# EAGLE schematic 20140816_PIC16F1827_BASE (EAGLE 7.1.0)
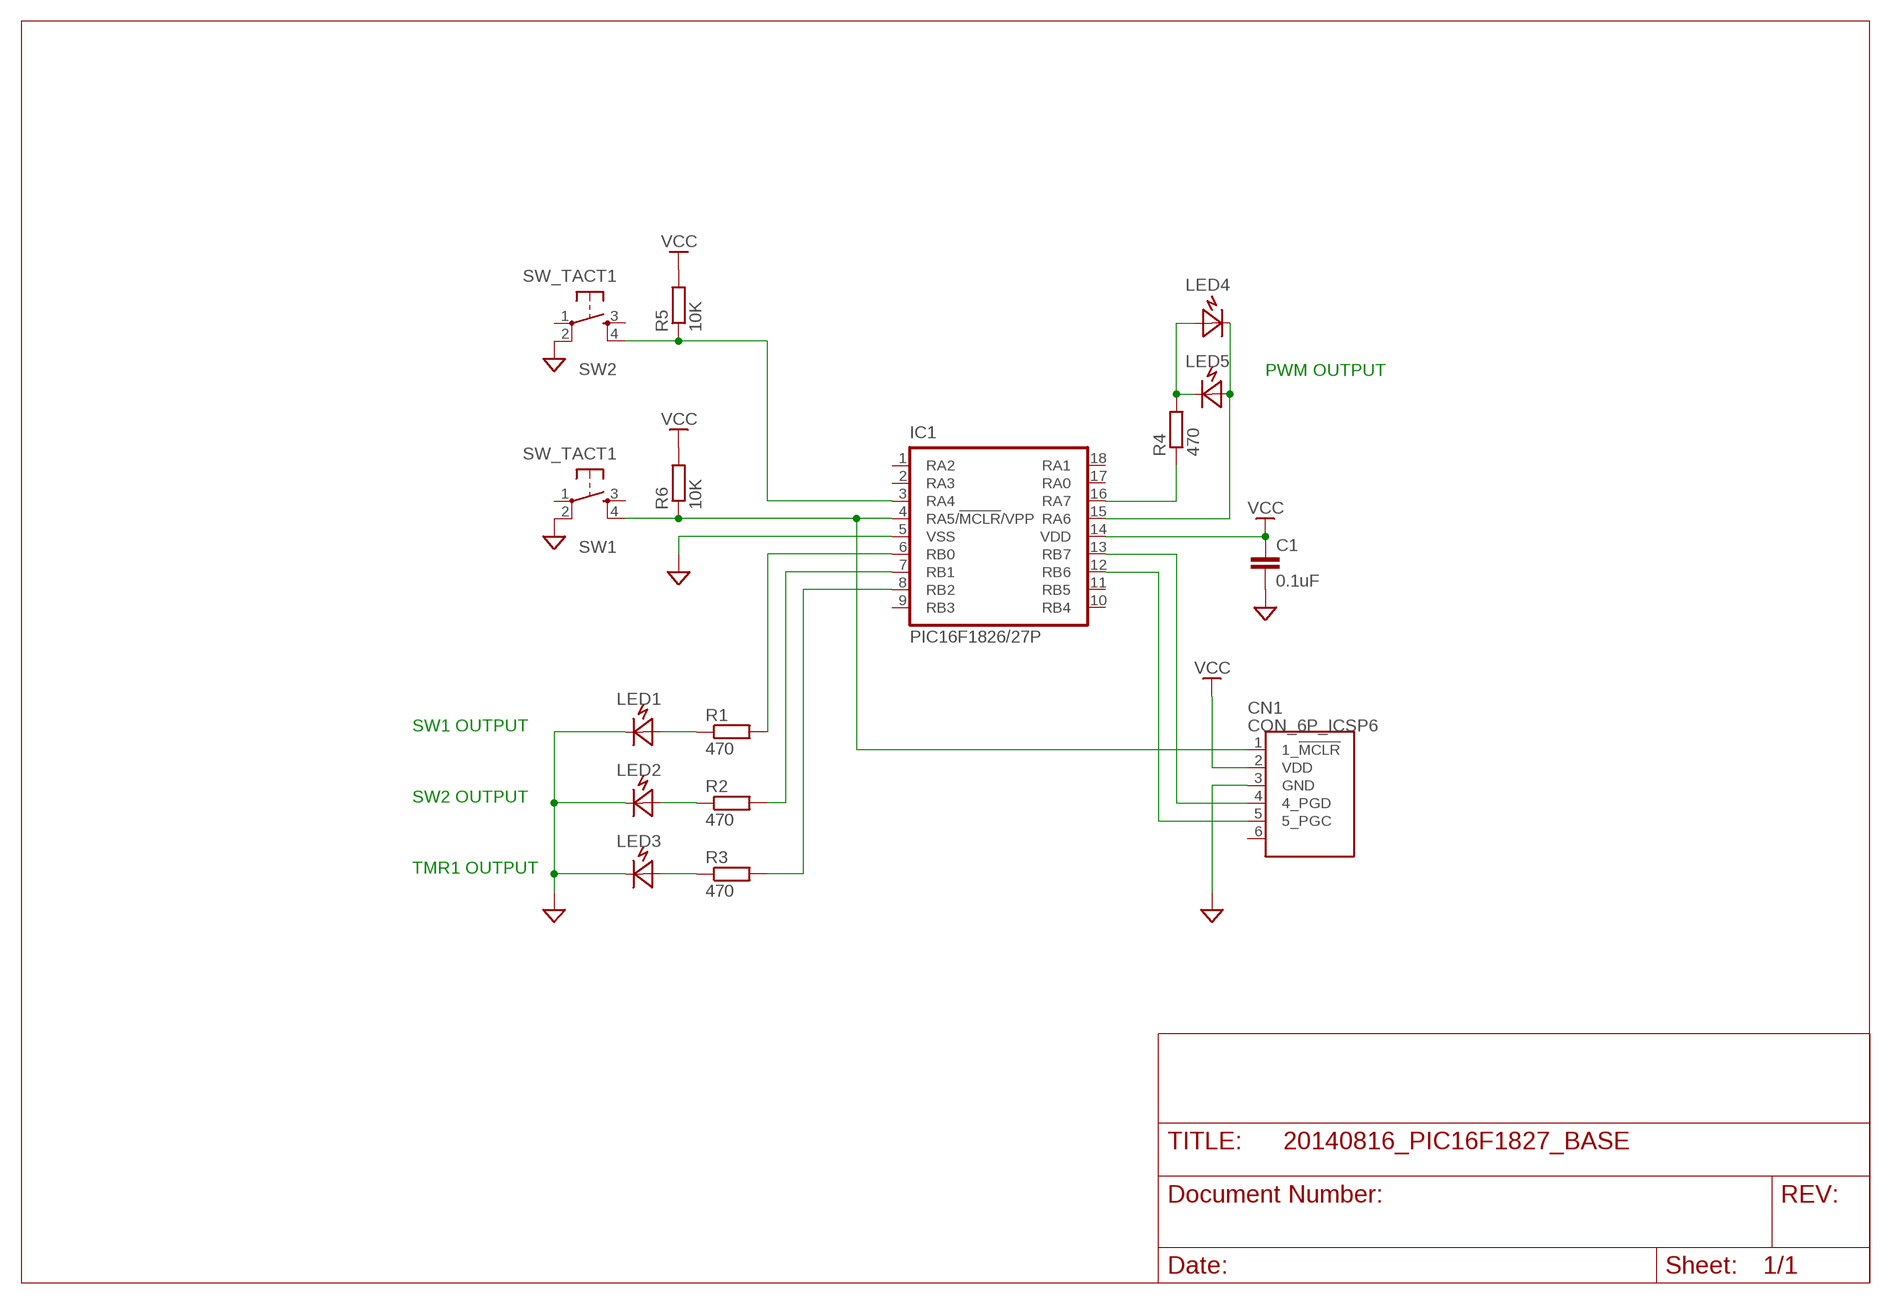
[diagram p0: schematic, sheet 1]

## Parts
C1  0.1uF  C-EU2025-025X050A  [C025-025X050-A]
CN1  CON_6P_ICSP6  [CON_HRS_DIP_6]
IC1  PIC16F1826/27P  [DIL18]
LED1  LED""  [LED_3MM_VIRT_2]
LED2  LED""  [LED_3MM_VIRT_2]
LED3  LED""  [LED_3MM_VIRT_2]
LED4  LED""  [LED_3MM_VIRT_2]
LED5  LED""  [LED_3MM_VIRT_2]
R1  470  R-EU20204/5A  [0204/5-A]
R2  470  R-EU20204/5A  [0204/5-A]
R3  470  R-EU20204/5A  [0204/5-A]
R4  470  R-EU20204/5A  [0204/5-A]
R5  10K  R-EU20204/5A  [0204/5-A]
R6  10K  R-EU20204/5A  [0204/5-A]
SW1  SW_TACT1  [SW_TACT]
SW2  SW_TACT1  [SW_TACT]

## Nets
GND: C1.2 CN1.3(GND) IC1.5(VSS) LED1.K LED2.K LED3.K SW1.2(P1) SW2.2(P1)
N$1: IC1.6(RB0) R1.2
N$2: IC1.7(RB1) R2.2
N$3: IC1.8(RB2) R3.2
N$4: LED1.A R1.1
N$5: LED2.A R2.1
N$6: LED3.A R3.1
N$7: CN1.1(1_!MCLR) IC1.4(RA5/!MCLR!/VPP) R6.1 SW1.4(S1)
N$8: IC1.3(RA4) R5.1 SW2.4(S1)
N$9: IC1.16(RA7) R4.1
N$10: LED4.A LED5.K R4.2
N$11: IC1.15(RA6) LED4.K LED5.A
N$12: CN1.4(4_PGD) IC1.13(RB7)
N$13: CN1.5(5_PGC) IC1.12(RB6)
VCC: C1.1 CN1.2(VDD) IC1.14(VDD) R5.2 R6.2
Unconnected: CN1.6 IC1.1(RA2) IC1.2(RA3) IC1.9(RB3) IC1.10(RB4) IC1.11(RB5) IC1.17(RA0) IC1.18(RA1) SW1.1(P) SW1.3(S) SW2.1(P) SW2.3(S)

## Notes on the sheet
- PWM OUTPUT
- SW1 OUTPUT
- SW2 OUTPUT
- TMR1 OUTPUT

## Library data of the parts
C1 = p20140816_PIC16F1827_BASE:C-EU2: CAPACITOR, European symbol
CN1 = p20140816_PIC16F1827_BASE:CON_6P_ICSP
IC1 = p20140816_PIC16F1827_BASE:PIC16*F1826/27: 18/20/28-Pin Flash Microcontrollers with nanoWatt XLP Technology Source: www.microchip.com PIC16F1827.pdf
LED1-LED5 = p20140816_PIC16F1827_BASE:LED: 3mm LED
R1-R6 = p20140816_PIC16F1827_BASE:R-EU2: RESISTOR, European symbol
SW1 SW2 = p20140816_PIC16F1827_BASE:SW_TACT: Tacticle Push Switch